# EAGLE design TrusskeyV2 (EAGLE 9.3.2)

## Sheet 1 of 3
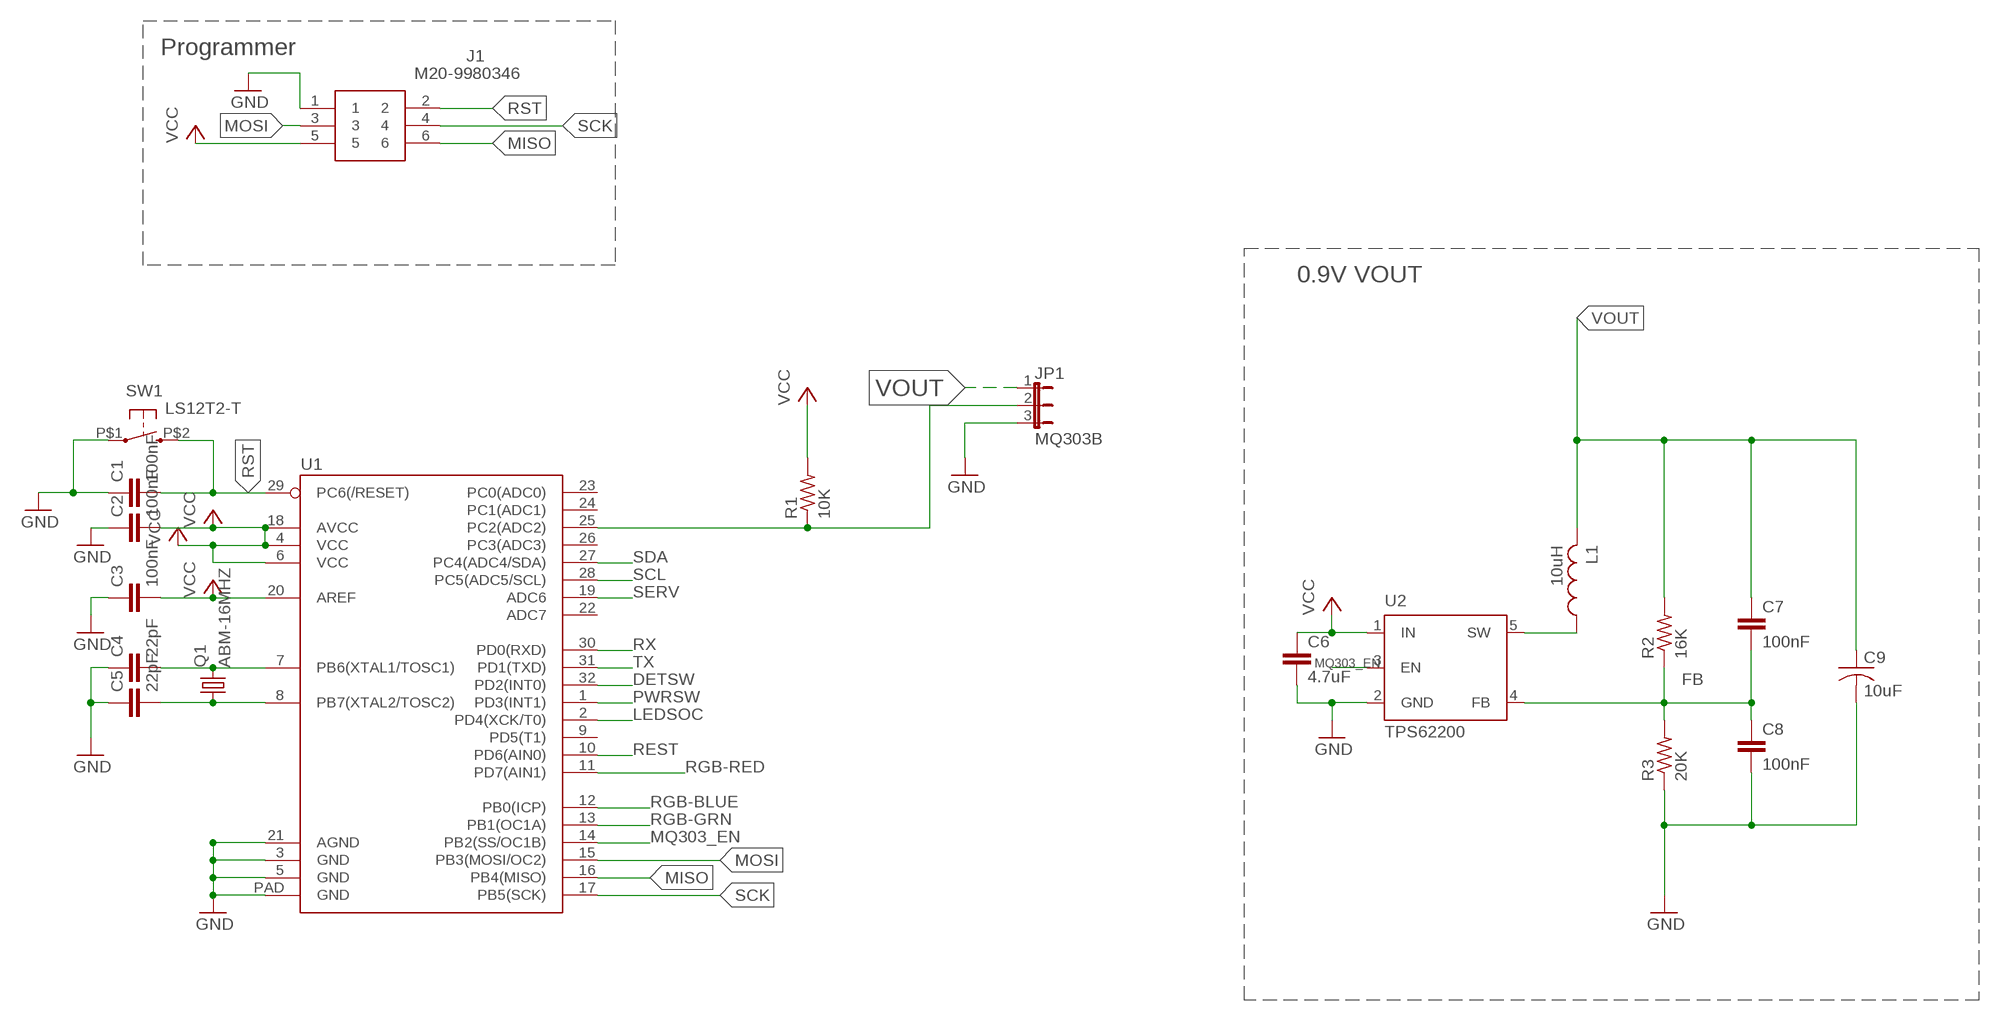
[diagram p0: schematic, sheet 1]

### Parts
C1  100nF  C-EUC0603  [C0603]
C2  100nF  C-EUC0603  [C0603]
C3  100nF  C-EUC0603  [C0603]
C4  22pF  C-EUC0603  [C0603]
C5  22pF  C-EUC0603  [C0603]
C6  4.7uF  C-EUC0402  [C0402]
C7  100nF  C-EUC0402  [C0402]
C8  100nF  C-EUC0402  [C0402]
C9  10uF  C-USC0805K  [C0805K]
J1  M20-9980346  [HDRV6W64P254_2X3_762X508X868P]
JP1  MQ303B  JP2E  [JP2]
L1  10uH  L-USL2825P  [L2825P]
Q1  ABM-16MHZ  [ABM-16MHZ]
R1  10K  R-US_R0402  [R0402]
R2  16K  R-US_R0402  [R0402]
R3  20K  R-US_R0402  [R0402]
SW1  LS12T2-T  [LS12T2-T]
U1  ATMEGA328P_MLFMLF32  [MLF32-PAD]
U2  TPS62200  [TPS62200]

### Nets
DETSW: U1.32(PD2(INT0)) ; also sheet 2
FB: C7.2 C8.1 R2.1 R3.2 U2.4(FB)
GND: C1.1 C2.1 C3.1 C4.1 C5.1 C6.2 C8.2 C9.2 J1.1 JP1.3 R3.1 SW1.P$1(S1) U1.3(GND) U1.5(GND) U1.21(AGND) U1.PAD(GND) U2.2(GND) ; also sheet 2,3
LEDSOC: U1.2(PD4(XCK/T0))
MISO: J1.6 U1.16(PB4(MISO))
MOSI: J1.3 U1.15(PB3(MOSI/OC2))
MQ303_EN: U1.14(PB2(SS/OC1B)) U2.3(EN)
N$1: C5.2 Q1.P$1 U1.8(PB7(XTAL2/TOSC2))
N$2: C4.2 Q1.P$2 U1.7(PB6(XTAL1/TOSC1))
N$3: JP1.2 R1.1 U1.25(PC2(ADC2))
PWRSW: U1.1(PD3(INT1)) ; also sheet 2
REST: U1.10(PD6(AIN0)) ; also sheet 2
RGB-BLUE: U1.12(PB0(ICP)) ; also sheet 2
RGB-GRN: U1.13(PB1(OC1A)) ; also sheet 2
RGB-RED: U1.11(PD7(AIN1)) ; also sheet 2
RST: C1.2 J1.2 SW1.P$2(S2) U1.29(PC6(/RESET))
RX: U1.30(PD0(RXD)) ; also sheet 2
SCK: J1.4 U1.17(PB5(SCK))
SCL: U1.28(PC5(ADC5/SCL)) ; also sheet 3
SDA: U1.27(PC4(ADC4/SDA)) ; also sheet 3
SERV: U1.19(ADC6) ; also sheet 2
SW: L1.1 U2.5(SW)
TX: U1.31(PD1(TXD)) ; also sheet 2
VCC: C2.2 C3.2 C6.1 J1.5 R1.2 U1.4(VCC) U1.6(VCC) U1.18(AVCC) U1.20(AREF) U2.1(IN) ; also sheet 2,3
VOUT: C7.1 C9.1 JP1.1 L1.2 R2.2
Unconnected: U1.9(PD5(T1)) U1.22(ADC7) U1.23(PC0(ADC0)) U1.24(PC1(ADC1)) U1.26(PC3(ADC3))

### Notes on the sheet
- Programmer
- 0.9V VOUT

## Sheet 2 of 3
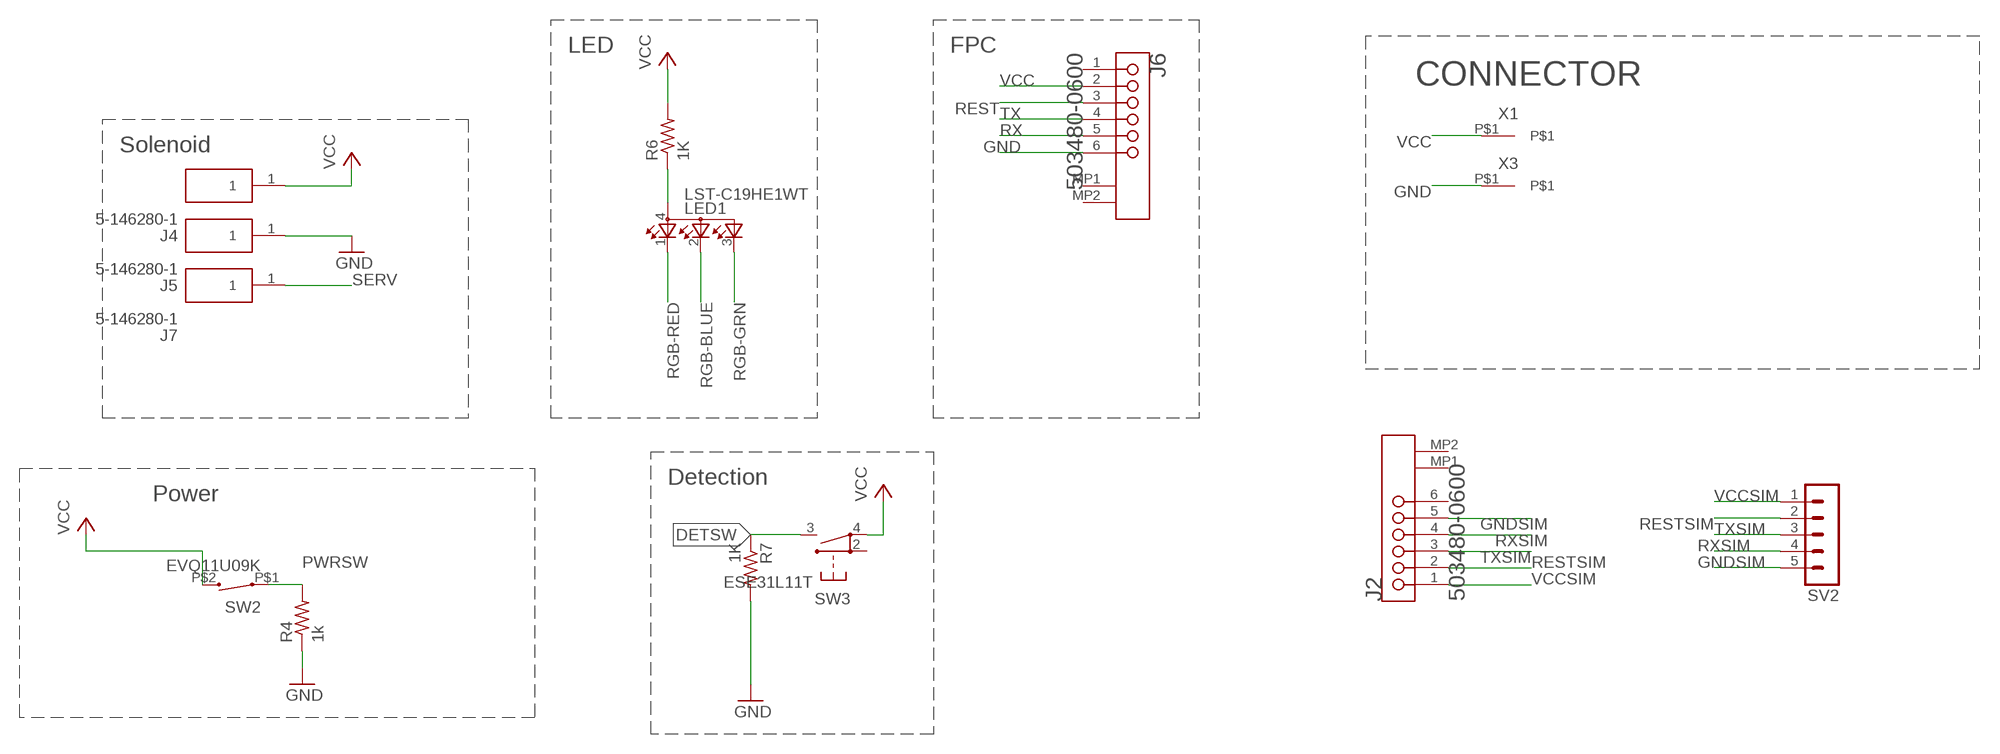
[diagram p1: schematic, sheet 2]

### Parts
J2  MOLEX_503480-0600MOLEX_503480-0600_0_0  [MOLEX_503480-0600_0]
J4  5-146280-1  [HDRV1W67P0X254_1X1_213X234X821]
J5  5-146280-1  [HDRV1W67P0X254_1X1_213X234X821]
J6  MOLEX_503480-0600MOLEX_503480-0600_0_0  [MOLEX_503480-0600_0]
J7  5-146280-1  [HDRV1W67P0X254_1X1_213X234X821]
LED1  LST-C19HE1WT  [LST-C19HE1WT]
R4  1k  R-US_R0402  [R0402]
R6  1K  R-US_R0402  [R0402]
R7  1K  R-US_R0402  [R0402]
SV2  MA05-1  [MA05-1]
SW2  EVQ11U09K  [EVQ11U-09K]
SW3  ESE31L11T  [SWITCH]
X1  CON-1PIN  [CON-1PIN]
X3  CON-1PIN  [CON-1PIN]

### Nets
DETSW: R7.1 SW3.3 ; also sheet 1
GND: J5.1 J6.6 R4.1 R7.2 X3.P$1 ; also sheet 1,3
GNDSIM: J2.5 SV2.5
N$5: LED1.4(A) R6.1
PWRSW: R4.2 SW2.P$1 ; also sheet 1
REST: J6.3 ; also sheet 1
RESTSIM: J2.2 SV2.2
RGB-BLUE: LED1.2(CGREEN) ; also sheet 1
RGB-GRN: LED1.3(CBLUE) ; also sheet 1
RGB-RED: LED1.1(CRED) ; also sheet 1
RX: J6.5 ; also sheet 1
RXSIM: J2.4 SV2.4
SERV: J7.1 ; also sheet 1
TX: J6.4 ; also sheet 1
TXSIM: J2.3 SV2.3
VCC: J4.1 J6.2 R6.2 SW2.P$2 SW3.4(C3) X1.P$1 ; also sheet 1,3
VCCSIM: J2.1 SV2.1
Unconnected: J2.6 J2.MP1 J2.MP2 J6.1 J6.MP1 J6.MP2 SW3.2(C2)

### Notes on the sheet
- LED | FPC
- CONNECTOR
- Solenoid
- Detection
- Power

## Sheet 3 of 3
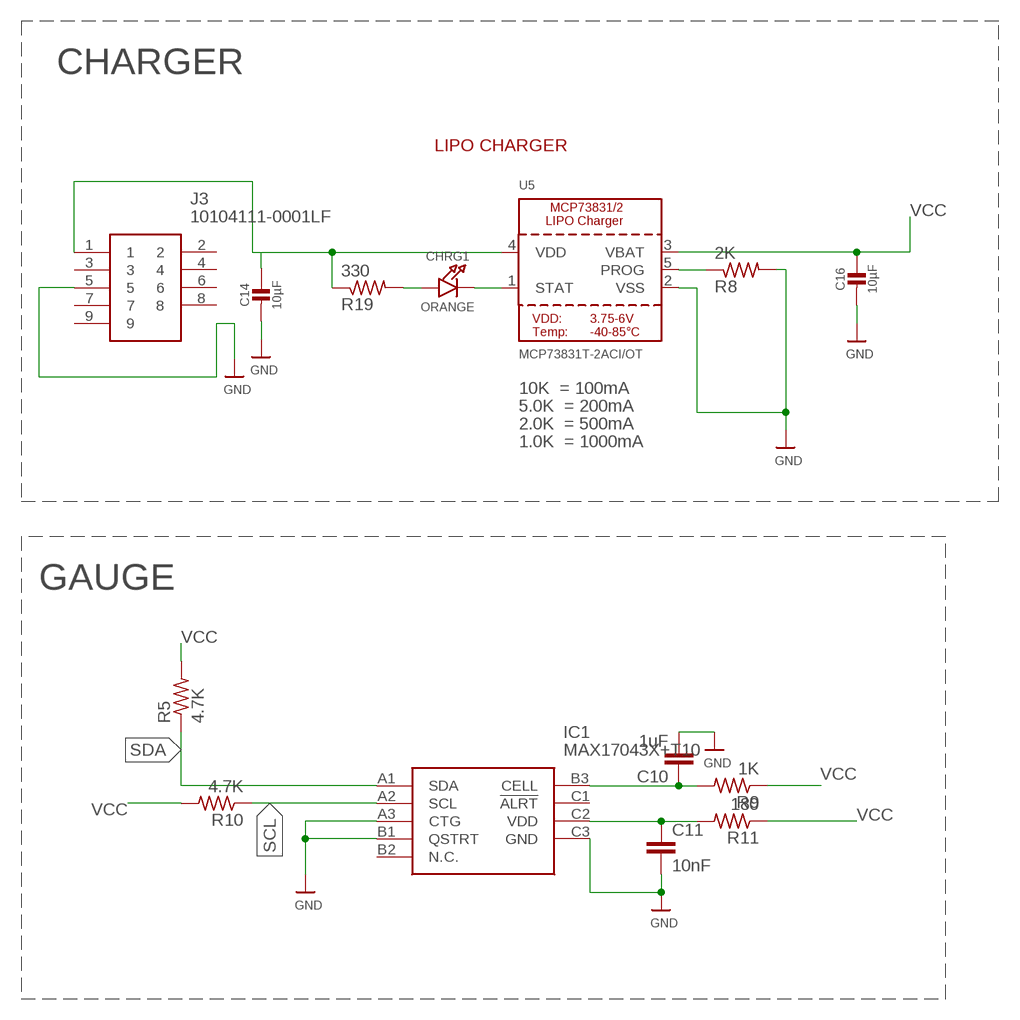
[diagram p2: schematic, sheet 3]

### Parts
C10  1uF  C-EUC0603  [C0603]
C11  10nF  C-EUC0603  [C0603]
C14  10µF  CAP_CERAMIC0805-NOOUTLINE  [0805-NO]
C16  10µF  CAP_CERAMIC0805-NOOUTLINE  [0805-NO]
CHRG1  ORANGE  LED0805_NOOUTLINE  [CHIPLED_0805_NOOUTLINE]
IC1  MAX17043X+T10  [BGA9C40P3X3_160X142X69]
J3  10104111-0001LF  [101041110001LF]
R5  4.7K  R-US_R0402  [R0402]
R8  2K  R-US_R0402  [R0402]
R9  1K  R-US_R0402  [R0402]
R10  4.7K  R-US_R0402  [R0402]
R11  180  R-US_R0402  [R0402]
R19  330  R-US_R0402  [R0402]
U5  MCP73831T-2ACI/OT  MCP73831/2  [SOT23-5]

### Nets
GND: C10.2 C11.2 C14.2 C16.2 IC1.A3(CTG) IC1.B1(QSTRT) IC1.C3(GND) J3.5 R8.2 U5.2(VSS) ; also sheet 1,2
N$9: C11.1 IC1.C2(VDD) R11.2
N$10: C10.1 IC1.B3(CELL) R9.2
N$12: R8.1 U5.5(PROG)
N$16: CHRG1.A R19.2
N$17: CHRG1.C U5.1(STAT)
SCL: IC1.A2(SCL) R10.1 ; also sheet 1
SDA: IC1.A1(SDA) R5.1 ; also sheet 1
VBUS2: C14.1 J3.1 R19.1 U5.4(VDD)
VCC: C16.1 R5.2 R9.1 R10.2 R11.1 U5.3(VBAT) ; also sheet 1,2
Unconnected: IC1.B2(N.C.) IC1.C1(!ALRT) J3.2 J3.3 J3.4 J3.6 J3.7 J3.8 J3.9

### Notes on the sheet
- CHARGER
- LIPO CHARGER
- 10K  = 100mA
- 5.0K  = 200mA
- 2.0K  = 500mA
- 1.0K  = 1000mA
- GAUGE

## Library data of the parts
C1-C8 C10 C11 = rcl:C-EU: CAPACITOR, European symbol
C9 = resistor:C-US: CAPACITOR, American symbol
C14 C16 = microbuilder:CAP_CERAMIC: Ceramic Capacitors For new designs, use the packages preceded by an '_' character since they are more reliable: The following footprints should be used on most boards: _0402 - Standard footprint for regular board layouts _0603 - Standard footprint for regular board layouts _0805 - Standard footprint for regular board layouts _1206 - Standard footprint for regular board layouts For extremely tight-pitch boards where space is at a premium, the following 'micro-pitch' footprints can be used (smaller pads, no silkscreen outline, etc.): _0402MP - Micro-pitch footprint for very dense/compact boards _0603MP - Micro-pitch footprint for very dense/compact boards _0805MP - Micro-pitch footprint for very dense/compact boards _1206MP - Micro-pitch footprint for very dense/compact boards
CHRG1 = microbuilder:LED: LED 0603 - 0603 Surface Mount Package 2mA: Green LED - Low Power (3.9mcd, 2ma, 1.7Vf) - Digikey: 475-2709-2-ND Orange LED - Low Power (9.8mcd, 2ma, 1.8Vf) - Digikey: 475-1194-2-ND Red LED - Low Power (5mcd, 2ma, 1.8Vf) - Digikey: 475-1195-2-ND Yellow LED - Low Power (7mcd, 2ma, 1.8Vf) - Digikey: 475-1196-2-ND 5mA: Blue LED - Low Power (17mcd, 5ma, 2.9Vf) - Digikey: LNJ937W8CRACT-ND 0805 - 0805 Surface Mount Package 2mA: Red LED (8.8mcd, 2mA, 1.8Vf, Clear) - Low Power [Digikey: 475-2510-1-ND] Green LED (5mcd, 2mA, 1.8Vf, Clear) - Low Power [Digikey: 475-2730-1-ND] Yellow LED (11.3mcd, 2mA, 1.8Vf, Clear) - Low Power [Digikey: 475-2555-1-ND] 20mA: Red LED (104mcd, 20mA, Diffused) - LS R976 [Digikey: 475-1278-6-ND] Red LED (12mcd, 20mA, 2.0Vf, Clear) - APT2012EC [Digikey: 754-1128-1-ND] Green LED (15mcd, 20mA, 2.2Vf, Clear) - APT2012GC [Digikey: 754-1131-1-ND] Orange LED (160mcd, 20mA, 2.1Vf, Clear) - APT2012SECK [Digikey: 754-1130-1-ND] 1206 - 1206 Surface Mount Package Green LED (26mcd, 20mA, Diffused) - LG N971 [Digikey: 475-1407-6-ND] Red LED (15mcd, 20mA, Diffused) - LH N974 [Digikey: 475-1416-6-ND] Cree - Cree High-Power Surface Mount LEDs XPEBWT-L1-0000-00D50 - White 111lm 350mA 2.9Vf 6200K 110° XTEAWT-00-0000-00000LEE3 - White 114lm 350mA 2.85Vf 5000K 115° Everlight - Everlight 45-21 Series Surface Mount LEDs 45-21/QK2C-B2832AC2CB2/2T - Warm White 2000mcd 20mA 3.25Vf 3050K 120° 45-21/LK2C-B38452C4CB2/2T - Nuetral White 2000mcd 20mA 3.25Vf 4150K 120° 45-21/LK2C-B50634C6CB2/2T - Cold White 2200mcd 20mA 3.25Vf 5650K 120° PLCC2 Reverse Mount LS T77K-J1L2-1-0-2-R18-Z - Red 11.25mcd 2mA 1.8Vf 630nm 120° LO T77K-L1M2-24-Z - Orange 19.6mcd 2mA 1.8Vf 606nm 120° LY T77K-K2M1-26-Z - Yellow 15.7mcd 2mA 1.8Vf 587nm 120°
IC1 = SamacSys_Parts:MAX17043X+T10: IC FUEL GAUGE LI-ION 1CELL 9UCSP Source: Datasheet <https://componentsearchengine.com/Datasheets/1/MAX17043X T10.pdf>; DESCRIPTION: IC FUEL GAUGE LI-ION 1CELL 9UCSP; HEIGHT: 0.69mm; MANUFACTURER_NAME: Maxim Integrated; MANUFACTURER_PART_NUMBER: MAX17043X+T10; MOUSER_PART_NUMBER: 700-MAX17043X+T10; MOUSER_PRICE-STOCK: https://www.mouser.com/Search/Refine.aspx?Keyword=700-MAX17043X%2BT10
J1 = M20-9980346:M20-9980346: 03+03 DIL Vertical Pin Header HARWIN M20 Series, 2.54mm Pitch 6 Way 2 Row Straight PCB Header, Solder Termination, 3A Source: Datasheet <https://componentsearchengine.com/Datasheets/1/M20-9980346.pdf>; DESCRIPTION: 03+03 DIL Vertical Pin Header HARWIN M20 Series, 2.54mm Pitch 6 Way 2 Row Straight PCB Header, Solder Termination, 3A; HEIGHT: 8.68mm; MANUFACTURER_NAME: HARWIN; MANUFACTURER_PART_NUMBER: M20-9980346; MOUSER_PART_NUMBER: 855-M20-9980346; MOUSER_PRICE-STOCK: https://www.mouser.com/Search/Refine.aspx?Keyword=855-M20-9980346
J2 J6 = Molex - 503480-0600:MOLEX_503480-0600: MOLX-503480-0600; CIIVA_IDS: 605048; CIRCUITS_LOADED: 6; COMPONENT_LINK_1_DESCRIPTION: Manufacturer URL; COMPONENT_LINK_1_URL: http://www.molex.com/molex/index.jsp; COMPONENT_LINK_3_DESCRIPTION: Package Specification; COMPONENT_LINK_3_URL: http://www.molex.com/pdm_docs/sd/5034800600_sd.pdf; CONTACT_POSITION: Dual; CURRENT_MAX_PER_CONTACT: 0.5A; DATASHEET: http://www.molex.com/webdocs/datasheets/pdf/en-us/5034800600_FFC_FPC_CONNECTORS.pdf; DURABILITY_MATING_CYCLES_MAX: 10; ENTRY_ANGLE: 90degrees Angle; FOOTPRINT_VARIANT_NAME_0: Manufacturer Recommended; IMPORTED: yes; IMPORTED_FROM: vault; IMPORT_TS: 1521858815; MATED_HEIGHT: 1.00mm; MATERIAL___METAL: Phosphor Bronze; MATERIAL___PLATING_MATING: Gold; MATERIAL___PLATING_TERMINATION: Gold, Tin; MF: Molex; MOUNTING_TECHNOLOGY: Surface Mount; MPN: 503480-0600; NUMBER_OF_ROWS: 1; ORIENTATION: Right Angle; PACKAGE: 503480-0600; PACKAGE_DESCRIPTION: 6-Lead FPC Connector, Pitch 0.5 mm; PACKAGE_VERSION: Rev. F, 09/2012; PACKING: Tape and Reel; PCB_LOCATOR: No; PCB_RETENTION: Yes; PITCH___MATING_INTERFACE: 0.50mm; POLARIZED_TO_PCB: Yes; PREFIX: J; RELEASE_DATE: 1411372331; ROHS: Yes; STACKABLE: No; VAULT_GUID: C3096111-9DEC-4C1E-8A9F-06C243124AF9; VAULT_REVISION: 2B4C6D7D-A1A5-4DF8-956F-B2470302EC0D; VOLTAGE_MAX: 50V AC (RMS)/DC
J3 = 10104111-0001LF:10104111-0001LF: USB Connectors 5P Quick Connect MicroUSB TypeAB Rcpt Source: Datasheet <https://www.mouser.de/datasheet/2/18/10104111-1361291.pdf>; DESCRIPTION: USB Connectors 5P Quick Connect MicroUSB TypeAB Rcpt; HEIGHT: 3.07mm; MANUFACTURER_NAME: FCI / Amphenol; MANUFACTURER_PART_NUMBER: 10104111-0001LF; MOUSER_PART_NUMBER: 649-10104111-0001LF
J4 J5 J7 = 5-146280-1:5-146280-1: AMP - TE CONNECTIVITY - 5-146280-1 - 01 MODII HDR SRST B/A LF Source: Datasheet <https://componentsearchengine.com/Datasheets/1/5-146280-1.pdf>; DESCRIPTION: AMP - TE CONNECTIVITY - 5-146280-1 - 01 MODII HDR SRST B/A LF; HEIGHT: 8.21mm; MANUFACTURER_NAME: TE Connectivity; MANUFACTURER_PART_NUMBER: 5-146280-1; MOUSER_PART_NUMBER: 571-51462801; MOUSER_PRICE-STOCK: https://www.mouser.com/Search/Refine.aspx?Keyword=571-51462801
JP1 = jumper:JP2E: JUMPER
L1 = resistor:L-US: INDUCTOR, American symbol
LED1 = led:LST-C19HE1WT
Q1 = NewPart:ABM-16MHZ: Crystal 16MHz 18pF
R1-R11 R19 = resistor:R-US_: RESISTOR, American symbol
SV2 = con-lstb:MA05-1: PIN HEADER; OC_FARNELL: unknown; OC_NEWARK: unknown
SW1 = NewPart:LS12T2-T: Side Switch for hardware reset
SW2 = NewPart:EVQ11U09K
SW3 = NewPart:ESE31L11T: Panasonic Detector Switch
U1 = SparkFun-DigitalIC:ATMEGA328P_MLF: 32-Pin Atmega328 part Commonly used on Arduino compatible boards Available in QFP and QFN packages TQFP is IC-09069 QFN is non-stock
U2 = NewPart:TPS62200: TI TPS62200 Buck Converter
U5 = microbuilder:MCP73831/2: MCP73831/2 LIPO Charger VDD: 3.75 - 6V Temp -40 - 85°C Programmable Charge Rate: 15-500mA NOTE: STAT is a tri-state logic output on the MCP73831 and an open-drain output on the MCP73832. SOT23-5 with 4.2V output and tri-state logic on STAT = MCP73831T-2ACI/OT
X1 X3 = NewPart:CON-1PIN: THROUGH HOLE FOR 1-PIN CONNECTOR

## Board
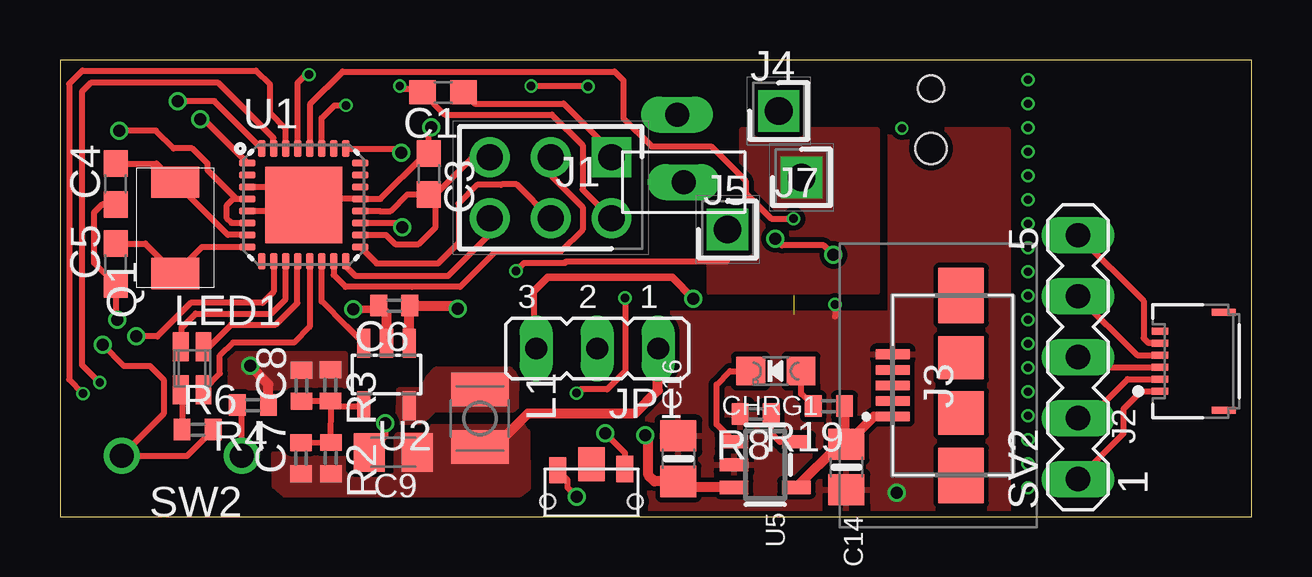
[diagram p3: board, top side]
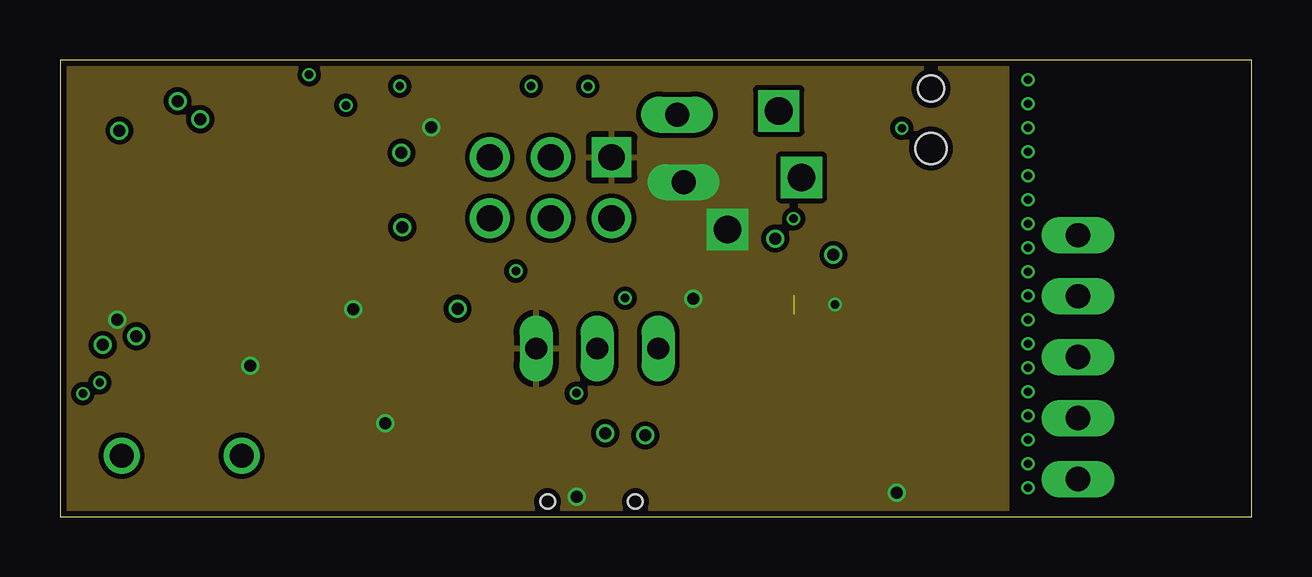
[diagram p4: board, inner layer Route2]
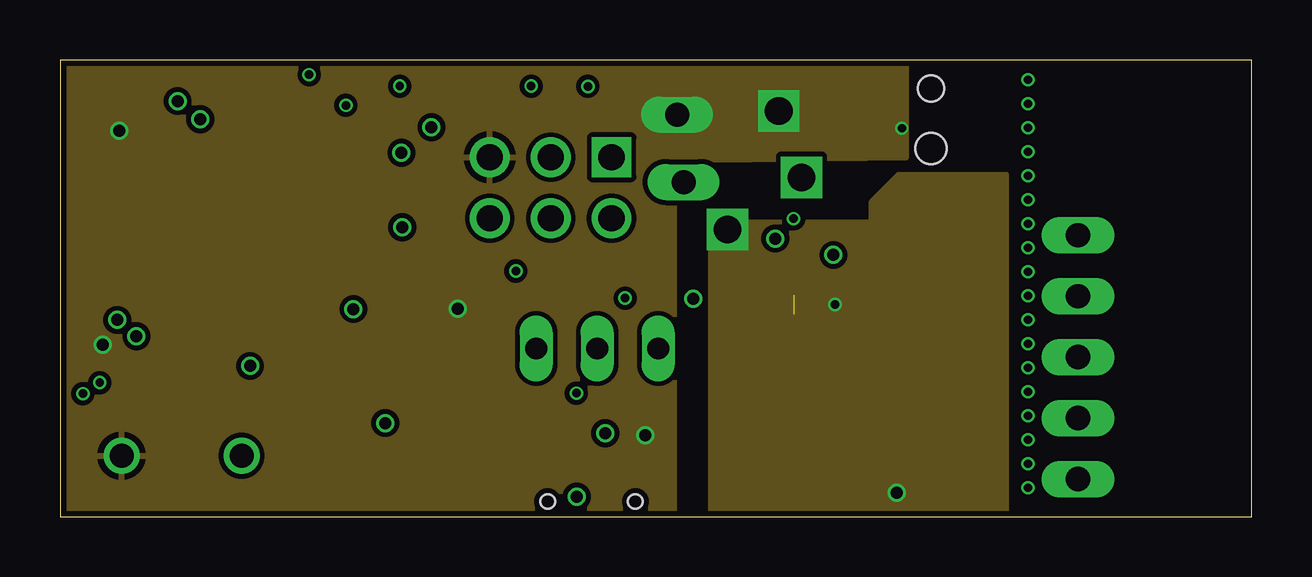
[diagram p5: board, inner layer Route15]
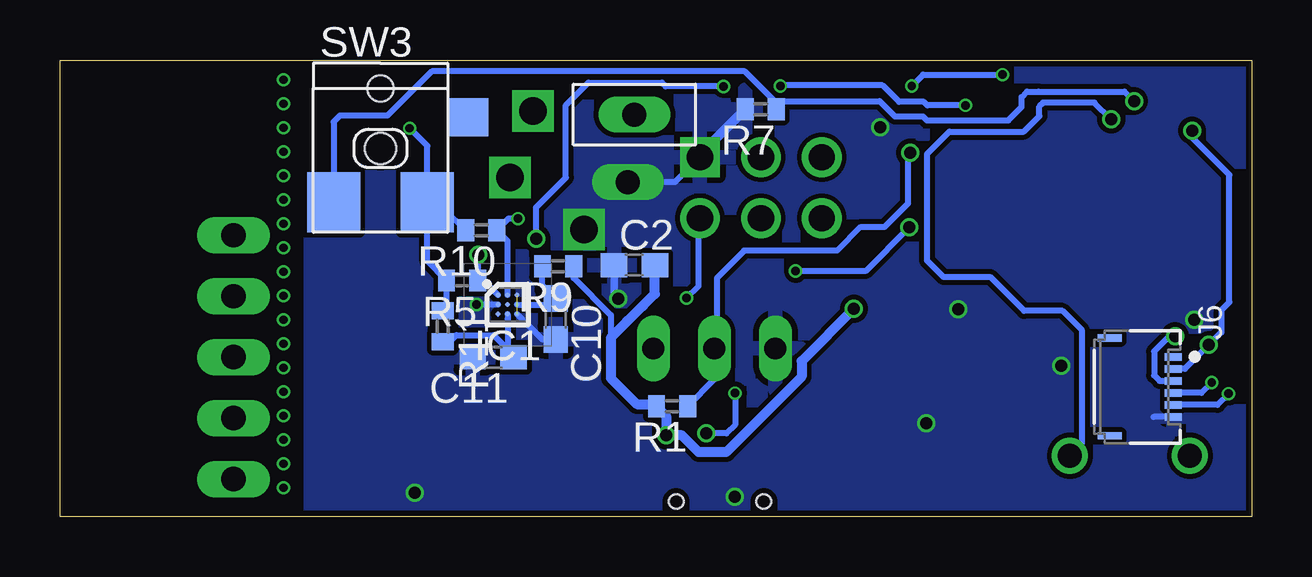
[diagram p6: board, bottom side, seen from below]

Size 49.65 x 19.03 mm. Coordinates in mm from the lower left corner, seen from the top.
Outline: 0,0 49.65,0 49.65,19.03 0,19.03 0,0
Copper layers (1*2*15*16): Top 0.035mm / dielectric 0.2mm / Route2 0.0175mm / dielectric 0.3mm / Route15 0.0175mm / dielectric 0.2mm / Bottom 0.035mm
Design rules "SeeedStudio_4layer_DRU_no_angle_20140221 *": minimum track width 8mil, minimum drill 12mil, track to track 8mil, track to pad 8mil, pad to pad 6mil, via to via 8mil, smd to smd 0mil, copper to edge 10mil, drill to drill 8mil, minimum pad ring 6mil, minimum via ring 4mil, stop-mask expansion 4mil, vias tented up to drill 25mil, thermal gap 10mil

### Footprints (pad centres in the part's own frame; a part is rotated, then mirrored left to right if it is on the bottom)
C0603 = smd 1.1 x 1: 1 -0.85,0; 2 0.85,0
C0402 = smd 0.7 x 0.9: 1 -0.65,0; 2 0.65,0
C0805K = smd 1.3 x 1.6: 1 -1,0; 2 1,0
0805-NO = smd 1.3 x 1.5: 1 -0.95,0; 2 0.95,0
CHIPLED_0805_NOOUTLINE = smd 1.2 x 1.2: A 0,-1.05; C 0,1.05
BGA9C40P3X3_160X142X69 = smd 0.216 x 0.216: A1 -0.4,0.4; A2 0,0.4; A3 0.4,0.4; B1 -0.4,0; B2 0,0; B3 0.4,0; C1 -0.4,-0.4; C2 0,-0.4; C3 0.4,-0.4
HDRV6W64P254_2X3_762X508X868P = drill 1.1 pad 1.65 square: 1 0,0 | drill 1.1 pad 1.65: 2 0,2.54; 3 2.54,0; 4 2.54,2.54; 5 5.08,0; 6 5.08,2.54
MOLEX_503480-0600_0 = smd 0.3 x 0.7: 1 -1.25,1.325; 2 -0.75,1.325; 3 -0.25,1.325; 4 0.25,1.325; 5 0.75,1.325; 6 1.25,1.325 | smd 0.3 x 1: MP1 -2.04,-1.325; MP2 2.04,-1.325
101041110001LF = smd 0.4 x 1.4: 1 -1.3,5; 2 -0.65,5; 3 0,5; 4 0.65,5; 5 1.3,5 | smd 2.3 x 1.9: 6 -3.75,2.15; 7 3.75,2.15 | smd 1.8 x 1.9: 8 -1.15,2.15; 9 1.15,2.15
HDRV1W67P0X254_1X1_213X234X821 = drill 1.15 pad 1.725 square: 1 0,0
JP2 = drill 0.914 long: 1 -2.54,0; 2 0,0; 3 2.54,0
L2825P = smd 1.4 x 2.4: 1 -1.2,0; 2 1.2,0
LST-C19HE1WT = smd 0.65 x 1.2: 1 -0.475,0.9; 2 0.475,0.9; 3 0.475,-0.9; 4 -0.475,-0.9
ABM-16MHZ = smd 1.3 x 2: P$1 0.6,-1.6; P$2 4.4,-1.6
R0402 = smd 0.7 x 0.9: 1 -0.65,0; 2 0.65,0
MA05-1 = drill 1.016 long: 1 -5.08,0; 2 -2.54,0; 3 0,0; 4 2.54,0; 5 5.08,0
LS12T2-T = smd 1.1 x 0.7: P$1 0.05,-1.41; P$2 0,1.39 | smd 1.4 x 1.1: P$3 -0.2,0 | hole 0.6: 1.35,-1.825; 1.35,1.825
EVQ11U-09K = drill 1: P$1 -2.5,0; P$2 2.5,0; P$3 -2.5,0
SWITCH = smd 1.7 x 1.6: 2 3.65,1.3 | smd 2.2 x 2.5: 3 -1.95,-2.25; 4 1.95,-2.25 | hole 1.1: 0,2.5 | hole 1.3: 0,0
MLF32-PAD = smd 0.7 x 0.3: 1 -2.35,1.75; 2 -2.35,1.25; 3 -2.35,0.75; 4 -2.35,0.25; 5 -2.35,-0.25; 6 -2.35,-0.75; 7 -2.35,-1.25; 8 -2.35,-1.75; 17 2.35,-1.75; 18 2.35,-1.25; 19 2.35,-0.75; 20 2.35,-0.25; 21 2.35,0.25; 22 2.35,0.75; 23 2.35,1.25; 24 2.35,1.75 | smd 0.3 x 0.7: 9 -1.75,-2.35; 10 -1.25,-2.35; 11 -0.75,-2.35; 12 -0.25,-2.35; 13 0.25,-2.35; 14 0.75,-2.35; 15 1.25,-2.35; 16 1.75,-2.35; 25 1.75,2.35; 26 1.25,2.35; 27 0.75,2.35; 28 0.25,2.35; 29 -0.25,2.35; 30 -0.75,2.35; 31 -1.25,2.35; 32 -1.75,2.35 | smd 3.2 x 3.2: PAD 0,0
TPS62200 = smd 0.55 x 1.2: 1 -0.95,-1.3; 2 0,-1.3; 3 0.95,-1.3; 4 0.95,1.3; 5 -0.95,1.3
SOT23-5 = smd 0.55 x 1.2: 1 -0.95,-1.3; 2 0,-1.3; 3 0.95,-1.3; 4 0.95,1.3; 5 -0.95,1.3
CON-1PIN = drill 1 long: P$1 0,0

### Placement (x,y rotation side)
C1  15.96,17.68 180 top
C2  25.71,10.47 0 bottom
C3  15.36,14.28 270 top
C4  2.31,13.87 90 top
C5  2.31,10.53 90 top
C6  13.93,8.79 180 top
C7  10.04,2.43 90 top
C8  10.06,5.46 90 top
C9  13.88,2.68 180 top
C10  29,8.24 270 bottom
C11  31.6,6.64 180 bottom
C14  32.77,2.07 270 top
C16  25.77,2.42 90 top
CHRG1  29.83,6.07 90 top
IC1  31,8.84 0 bottom
J1  22.99,14.98 180 top
J2  47.16,6.48 90 top
J3  39.7,5.47 90 top
J4  29.95,16.91 0 top
J5  27.82,11.97 0 top
J6  4.59,5.41 270 bottom
J7  30.9,14.14 0 top
JP1  22.38,7.01 180 top
L1  17.5,4.1 270 top
LED1  5.51,6.19 0 top
Q1  3.21,9.53 90 top
R1  24.14,4.6 180 bottom
R2  11.28,2.44 270 top
R3  11.27,5.47 270 top
R4  8.04,4.65 180 top
R5  32.9,9.84 180 bottom
R6  5.74,3.63 0 top
R7  20.45,16.98 180 bottom
R8  28.99,4.28 180 top
R9  28.9,10.44 180 bottom
R10  32.1,11.94 180 bottom
R11  33.7,7.94 270 bottom
R19  32.04,4.61 180 top
SV2  42.42,6.65 90 top
SW1  22.15,1.99 270 top
SW2  5.07,2.54 180 top
SW3  36.29,15.34 0 bottom
U1  10.16,12.99 0 top
U2  13.61,5.93 180 top
U5  29.39,2.17 270 top
X1  25.72,16.76 270 bottom
X3  25.99,13.94 90 top

### Tracks (layer width: path | path; a pad name or v marks a point on that pad's centre or on a via)
DETSW  (via drill 0.5)
  Top 0.254: v4.9,17.32 6.43,17.32 U1.32
  Bottom 0.254: v4.9,17.32 5.29,17.71 8.87,17.71 8.88,17.71 9.36,17.71 9.58,17.49 9.58,17.07 10.13,16.52 13.53,16.52 13.7,16.68 14.86,16.68 15.49,17.32 19.46,17.32 R7.1 19.8,17.25 21.11,18.56 34.15,18.56 36,16.71 37.99,16.71 38.24,16.45 SW3.3
FB
  Top 0.254: R3.2 11.04,4.61 12.64,4.61 U2.4 | C7.2 R2.1 11.29,4.73 R3.2 | C8.1 arc-90 10.08,4.82 R3.2
GND  (via drill 0.35, 0.5)  (1 unrouted)
  Top 0.254: U1.3 9.41,13.74 U1.PAD | U1.5 9.91,12.74 U1.PAD | U1.PAD 10.41,13.24 U1.21 13.35,13.24 15.11,15 15.23,15 C3.1 15.36,16.11 v15.48,16.22 | C4.1 1.76,13.01 1.42,12.67 1.42,10.57 C5.1 2.31,8.27 v2.39,8.2 | v13.55,3.9 13.55,3.35 C9.2 | 19.74,9.39 19.74,7.11 JP1.3 | C1.1 17.28,17.21 20.98,17.21 22.99,15.21 J1.1 | SW1.P$1 21.14,1.54 21.14,1.22 v21.53,0.83 | v32.3,8.84 32.3,8.34
  Top 0.305: v12.23,8.65 13.14,8.65 C6.2 | 19.74,9.39 20.32,9.97 25.5,9.97 v26.38,9.09
  Top 0.406: U2.2 13.61,8.46 C6.2 | R4.1 8.69,5.51 v7.92,6.28
  Bottom 0.203: 29.3,7.39 C10.2
  Bottom 0.254: J6.6 4.08,4.16 | J1.1 24.03,13.94 X3.P$1 | IC1.B1 v32.3,8.84 | IC1.C3 29.55,7.39 C10.2
  Bottom 0.305: v26.38,9.09 26.56,9.27 C2.1
  Bottom 0.406: R7.2 22.99,15.09 J1.1
  other vias: 34.87,1
  pour Top (no thermals): 7.29,6.79 11.87,6.79 11.87,5.37 8.89,5.37 7.27,5.34 7.12,5.49 7.08,6.57
  pour Bottom: 0.25,18.96 29.59,18.71 29.59,16.92 30.45,16.06 38.96,16.06 39.21,15.81 39.21,0.16 0.5,0.16 0.25,0.42
  pour Route2: 0.21,18.88 39.43,18.88 39.43,0.1 0.21,0.1 0.21,18.87
  pour Top: 34.63,16.12 39.49,16.12 39.49,-0.02 24.25,-0.02 24.25,8.48 34.62,8.48 34.62,16.14
  pour Route15: 33.83,12.27 33.83,13.13 34.96,14.26 39.42,14.25 39.42,0.15 27.13,0.15 27.13,11.81 27.59,12.27
GNDSIM
  Top 0.254: SV2.5 45.15,8.99 45.15,7.44 45.34,7.25 45.81,7.25 J2.5
MISO
  Top 0.254: U1.16 11.91,10.44 12.31,10.04 16.18,10.04 17.93,11.79 17.91,11.81 J1.6
MOSI
  Top 0.254: U1.15 11.41,10.08 11.91,9.58 14.67,9.58 16.68,9.58 18.13,11.03 20.85,11.03 21.78,11.96 21.78,12.9 20.52,14.16 20.52,14.9 J1.3
MQ303_EN
  Top 0.254: U2.3 11.94,7.94 10.91,8.97 U1.14
N$1
  Top 0.254: C5.2 3.56,11.38 Q1.P$1 5.92,11.24 U1.8
N$2
  Top 0.254: U1.7 7,11.74 Q1.P$2 4.02,14.71 C4.2
N$3  (via drill 0.5)
  Top 0.254: v14.23,15.16 14.05,15.34 U1.25
  Bottom 0.254: R1.1 22.38,5.72 JP1.2 22.28,7.11 22.28,9.94 21.14,11.08 18.43,11.08 17.27,11.08 16.28,12.08 15.29,12.08 14.31,13.06 14.31,15.09 v14.23,15.16
N$4  (via drill 0.35)
  other vias: 40.34,18.21
N$5
  Top 0.254: LED1.4 5.09,5.23 R6.1
N$6  (via drill 0.35)
  other vias: 40.34,17.21
N$7  (via drill 0.35)
  other vias: 40.34,16.21
N$8  (via drill 0.35)
  other vias: 40.34,15.21
N$9
  Bottom 0.254: 31,8.24 IC1.C2 31,6.99 | 33.65,7.24 R11.2 33.41,7.29 33.13,7.57 31.58,7.57 31,6.99 | 31,6.99 30.97,6.96 30.97,6.86 C11.1
N$10
  Bottom 0.254: R9.2 29.55,9.64 C10.1 29.25,8.84 IC1.B3
N$11  (via drill 0.35)
  other vias: 40.34,14.21
N$12
  Top 0.254: U5.5 30,3.12 29.64,3.48 R8.1
N$13  (via drill 0.35)
  other vias: 40.34,13.21
N$14  (via drill 0.35)
  other vias: 40.34,12.21
N$15  (via drill 0.35)
  other vias: 40.34,11.21
N$16
  Top 0.254: R19.2 30.88,5.12 CHRG1.A
N$17
  Top 0.254: U5.1 27.36,3.85 27.36,5.51 27.92,6.07 CHRG1.C
N$18  (via drill 0.35)
  other vias: 40.34,10.21
N$19  (via drill 0.35)
  other vias: 40.34,8.21
N$20  (via drill 0.35)
  other vias: 40.34,7.21
N$21  (via drill 0.35)
  other vias: 40.34,6.21
N$22  (via drill 0.35)
  other vias: 40.34,5.21
N$23  (via drill 0.35)
  other vias: 40.34,9.21
N$24  (via drill 0.35)
  other vias: 40.34,4.21
N$25  (via drill 0.35)
  other vias: 40.34,3.21
N$26  (via drill 0.35)
  other vias: 40.34,2.21
N$27  (via drill 0.35)
  other vias: 40.34,1.21
PWRSW  (via drill 0.5)
  Top 0.203: 7.57,4.47 R4.2
  Top 0.254: R4.2 arc-90 7.57,4.47 SW2.P$1 | v5.85,16.56 5.99,16.56 U1.1
  Bottom 0.254: v5.85,16.56 6.55,17.26 8.68,17.26 8.84,17.09 8.84,16.69 9.49,16.05 12.59,16.05 13.53,15.11 13.53,10.68 12.84,9.99 10.89,9.99 9.48,8.58 7.87,8.58 7.06,7.77 7.06,3.05 SW2.P$1
REST  (via drill 0.5)
  Top 0.254: U1.10 8.91,9.38 8.44,8.91 5.46,8.91 4.06,7.52 v3.19,7.52
  Bottom 0.254: v3.19,7.52 3.43,7.52 4.06,6.88 4.06,5.89 3.83,5.66 J6.3
RESTSIM
  Top 0.254: SV2.2 42.87,4.11 44.49,5.73 J2.2
RGB-BLUE
  Top 0.254: LED1.2 6.22,7.09 7.13,8 8.99,8 9.89,8.9 9.89,10.62 U1.12
RGB-GRN
  Top 0.254: LED1.3 6.67,5.97 6.67,6.72 7.21,7.26 9.76,7.26 10.41,7.91 U1.13
RGB-RED
  Top 0.254: LED1.1 5.07,7.12 5.07,7.88 5.65,8.46 8.8,8.46 9.41,9.07 U1.11
RST  (via drill 0.35, 0.5)
  Top 0.254: v22.72,3.48 23.54,2.66 SW1.P$2 | U1.29 9.91,18.07 10.25,18.42 v10.38,18.42 | v14.16,17.94 14.28,17.82 14.97,17.82 C1.2 16.03,16.76 20.5,16.76 21.78,15.48 21.78,13.63 22.97,12.44 J1.2 | v21.52,5.15 21.68,5.31 22.8,5.31 23.55,6.05 v23.55,9.11
  Bottom 0.254: v14.16,17.94 13.68,18.42 v10.38,18.42 | v23.55,9.11 23.04,9.61 23.04,12.38 J1.2 | v21.52,5.15 21.52,3.83 21.88,3.47 v22.71,3.47 v22.72,3.48
RX  (via drill 0.35)
  Top 0.254: U1.30 9.39,15.35 9.39,16.17 8.76,16.8 8.76,17.99 8.16,18.59 0.94,18.59 0.38,18.03 0.38,5.72 0.96,5.15 v0.96,5.13
  Bottom 0.254: J6.5 1.43,4.66 v0.96,5.13
RXSIM
  Top 0.254: SV2.4 44.88,6.73 J2.4
SCK
  Top 0.254: U1.17 13.19,10.56 15.76,10.56 16.61,11.41 16.61,13.05 17.38,13.82 18.38,13.82 18.41,13.85 19.02,13.85 20.43,12.44 J1.4
SCL  (via drill 0.35)
  Top 0.254: U1.28 10.41,17.18 11.78,18.55 23.11,18.55 23.48,18.18 23.48,16.6 24.65,15.43 27.13,15.43 28.57,13.99 28.57,13.49 29.64,12.42 v30.57,12.42
  Bottom 0.254: v30.57,12.42 30.97,12.42 R10.1 31,11.49 IC1.A2
SDA  (via drill 0.35, 0.5)
  Top 0.254: U1.27 10.91,16.61 11.44,17.14 v11.91,17.14 | v22,17.93 21.98,17.94 v19.63,17.94 | v32.23,10.91 31.82,11.31 30.08,11.31 v29.81,11.59
  Bottom 0.203: 32.43,10.02 R5.1
  Bottom 0.254: v11.91,17.14 13.51,17.14 13.65,17.28 14.68,17.28 15.37,17.97 19.6,17.97 v19.63,17.94 | v29.81,11.59 29.81,12.89 28.57,14.13 28.57,17.15 27.63,18.09 24.57,18.09 24.41,17.93 v22,17.93 | v32.23,10.91 32.25,10.89 R5.1 32,9.84 IC1.A1
SERV  (via drill 0.35, 0.5)
  Top 0.254: U1.19 14.08,12.24 v14.26,12.06 | v19,10.24 19.34,10.58 21.04,10.58 21.1,10.64 27.8,10.64
  Bottom 0.254: v19,10.24 16.08,10.24 v14.26,12.06
  pour Top: 28.43,16.12 34.04,16.12 34.04,9.37 27.07,9.37 27.07,12.27 28.43,12.27
SW
  pour Top (no thermals): 14.19,5.26 14.12,5.26 14.1,4.04 14.25,3.94 15.03,3.96 15.32,4.21 15.59,4.48 15.95,4.48 18.86,4.46 19.02,4.6 19.03,5.88 18.75,6.12 16.45,6.14 15.65,6.11 15.34,5.79 15.07,5.27
TX  (via drill 0.35)
  Top 0.254: U1.31 8.89,15.36 8.89,15.78 6.59,18.08 1.29,18.08 0.92,17.71 0.92,6.33 v1.65,5.59
  Bottom 0.254: v1.65,5.59 2.09,5.16 J6.4
TXSIM
  Top 0.254: SV2.3 42.84,6.23 J2.3
VBUS2
  Top 0.406: R19.1 32.69,3.1 C14.1 | U5.4 32.49,3.02 C14.1 | J3.1 33.92,4.17 C14.1
VCC  (via drill 0.35, 0.5)
  Top 0.254: U1.20 13.34,12.74 13.33,12.74 13.78,12.74 14.47,13.43 C3.2 15.66,13.43 | U1.6 7.15,12.24 6.96,12.43 6.96,12.98 7.21,13.24 U1.4 7.35,13.24 6.14,14.45 6.14,14.72 5.5,15.35 4.73,15.35 4,16.09 v2.48,16.09 | v1.78,7.16 2.66,6.27 3.76,6.27 4.32,5.71 4.32,4.28 SW2.P$2 5.3,2.54 R6.2 | 15.66,13.43 15.66,12.07 14.94,11.35 13.97,11.35 13.58,11.74 U1.18 | 26.02,1.22 C16.1 | J1.5 17.2,14.98 15.66,13.43
  Top 0.406: U5.3 26.02,1.22 | C16.1 24.78,1.47 24.52,1.73 24.52,3.26 v24.39,3.39 | U2.1 14.56,8.77 C6.1 | C6.1 14.76,8.97 | C6.1 16.43,8.79 v16.57,8.66
  Bottom 0.254: v1.78,7.16 1.26,7.68 1.26,8.61 0.93,8.94 0.93,14.25 2.48,15.8 v2.48,16.09 | 1.69,7.16 v1.78,7.16 | SW3.4 34.34,15.45 v35.08,16.19 | SW3.4 34.07,12.82 33.63,12.82 R10.2 | J6.2 2.78,6.16 v1.78,7.16 | SW3.4 34.34,10.63 R5.2 33.55,8.74 R11.1 | R9.1 28.25,9.95 26.7,8.4 26.7,7.45
  Bottom 0.406: C2.2 24.86,9.29 25.36,8.79 25.37,8.79 26.01,8.15 26.01,8.14 26.7,7.45 26.7,5.78 25.61,4.69 24.88,4.69 R1.2 24.39,4.19 v24.39,3.39 23.73,3.39 23.04,2.69 21.89,2.69 18.75,5.84 18.75,6.48 v16.57,8.66
  pour Route15: 0.22,18.9 35.25,18.9 35.25,14.96 25.57,14.83 25.57,0.17 0.21,0.14 0.21,18.89
VCCSIM
  Top 0.254: SV2.1 44.32,3.47 44.32,4.5 45.05,5.23 J2.1
VOUT
  Top 0.406: JP1.1 24.92,5.27 23.95,4.3 19.5,4.3 18.1,2.9 L1.2
  pour Top (no thermals): 8.93,2.62 11.63,2.61 11.78,2.47 11.77,1.86 11.91,1.7 13.86,1.69 14.03,1.75 14.03,3.35 14.09,3.41 15.3,3.43 15.55,3.75 15.82,3.76 19.29,3.75 19.48,3.53 19.5,1.19 19.12,0.92 9.4,0.89 8.95,1.28